# EAGLE design node-double (EAGLE 9.1.1)
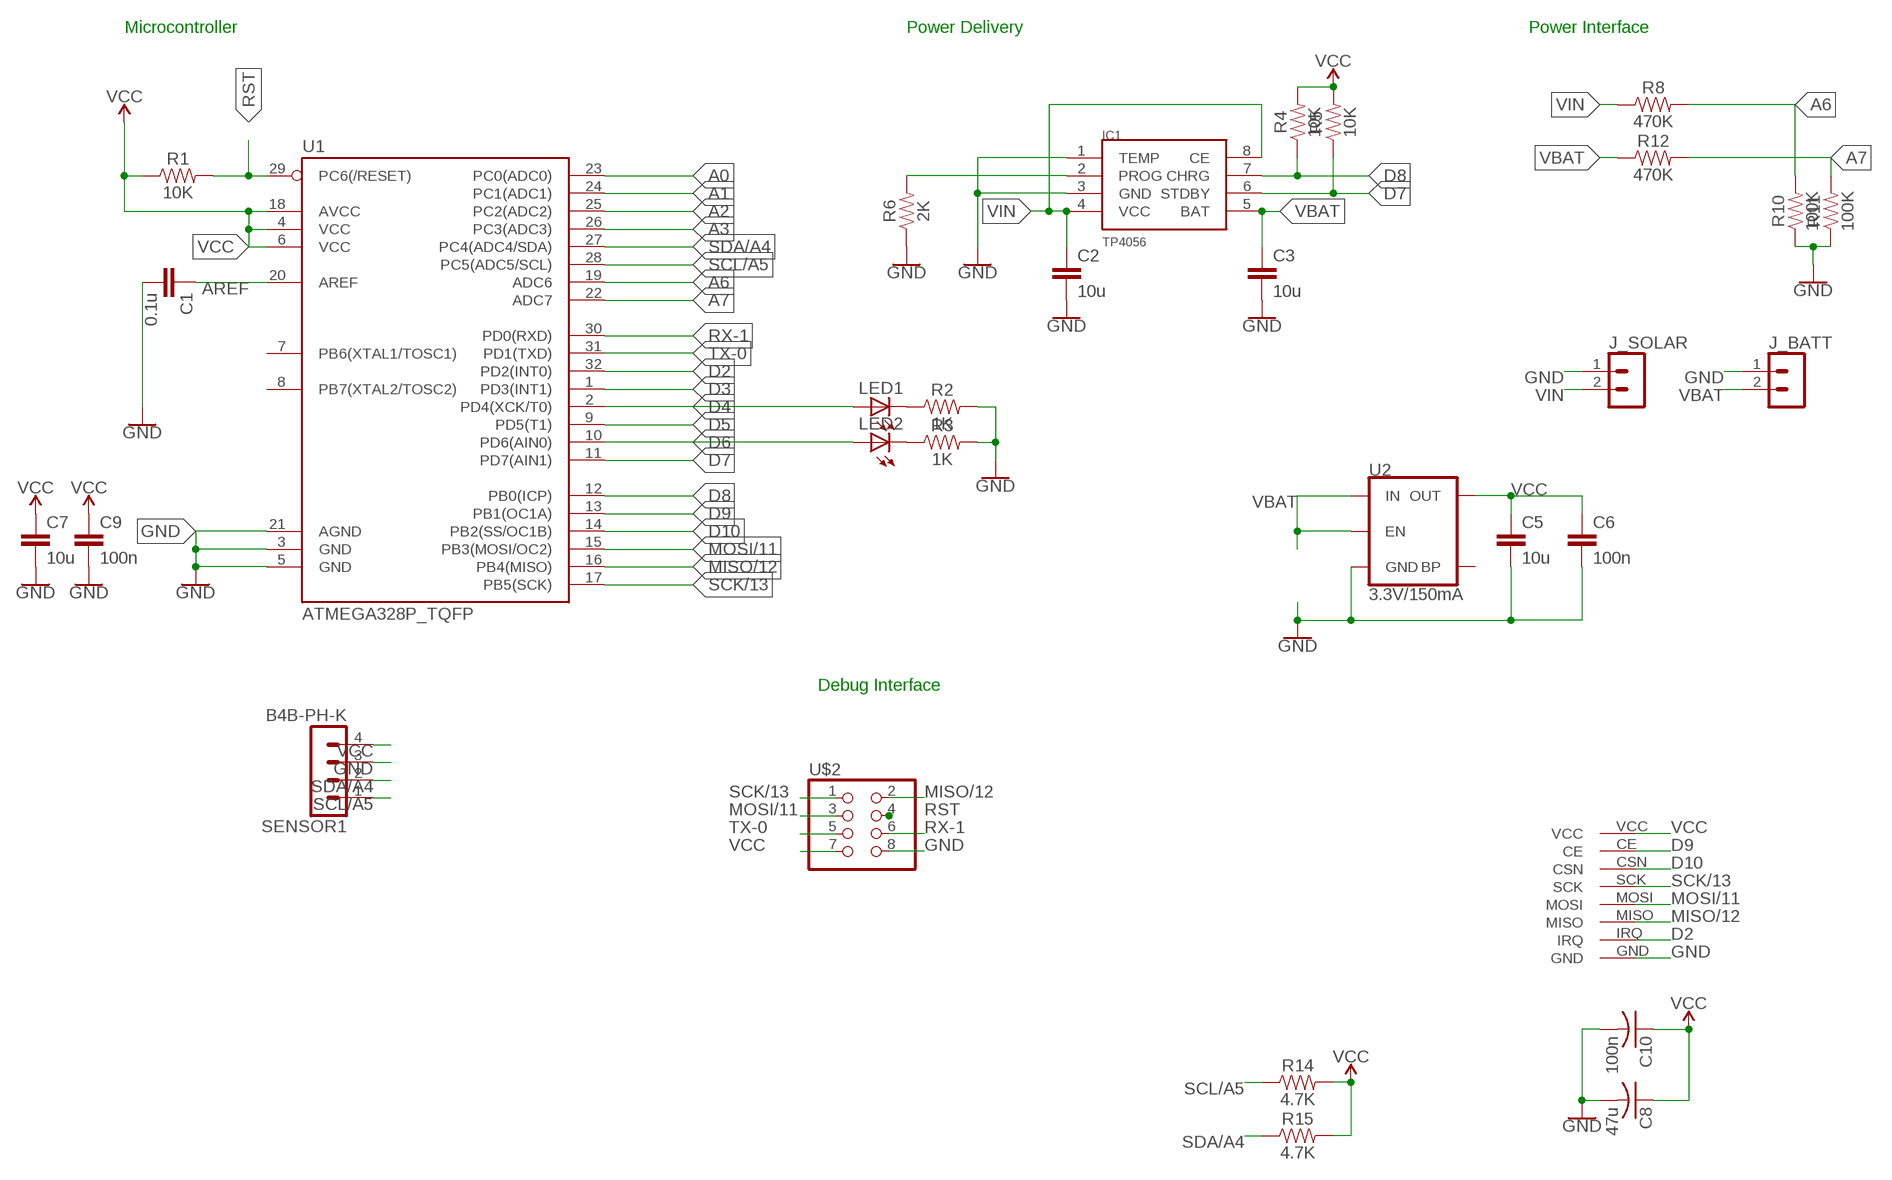
[diagram p0: schematic, sheet 1]

## Parts
C1  0.1u  CAPACITOR_0603_L  [RESC0603_L]
C2  10u  CAPACITOR_0603_L  [RESC0603_L]
C3  10u  CAPACITOR_0603_L  [RESC0603_L]
C5  10u  CAPACITOR_0603_L  [RESC0603_L]
C6  100n  CAPACITOR_0603_L  [RESC0603_L]
C7  10u  CAPACITOR_0603_L  [RESC0603_L]
C8  47u  C-USC0603  [C0603]
C9  100n  CAPACITOR_0603_L  [RESC0603_L]
C10  100n  C-USC0603  [C0603]
IC1  TP4056  [SOP-8]
J_BATT  B2B-PH-K  [B2B-PH-K]
J_SOLAR  B2B-PH-K  [B2B-PH-K]
LED1  LEDSML0805  [SML0805]
LED2  LEDSML0805  [SML0805]
R1  10K  RESISTOR0603  [0603]
R2  1K  RESISTOR0603  [0603]
R3  1K  RESISTOR0603  [0603]
R4  10K  RESISTOR0603  [0603]
R5  10K  RESISTOR0603  [0603]
R6  2K  RESISTOR0603  [0603]
R8  470K  RESISTOR0603  [0603]
R10  100K  RESISTOR0603  [0603]
R11  100K  RESISTOR0603  [0603]
R12  470K  RESISTOR0603  [0603]
R14  4.7K  RESISTOR0603  [0603]
R15  4.7K  RESISTOR0603  [0603]
SENSOR1  B4B-PH-K  [B4B-PH-K]
U1  ATMEGA328P_TQFP  [TQFP32-08]
U2  3.3V/150mA  V_REG_MIC52053.3V  [SOT23-5]
U$1  ML01SSMD-SOM  [ML01S]
U$2  PINHD-2X4  [2X04]

## Nets
A0: U1.23(PC0(ADC0))
A1: U1.24(PC1(ADC1))
A2: U1.25(PC2(ADC2))
A3: U1.26(PC3(ADC3))
A6: R8.2 R10.2 U1.19(ADC6)
A7: R11.2 R12.2 U1.22(ADC7)
AREF: C1.1 U1.20(AREF)
D2: U1.32(PD2(INT0)) U$1.IRQ
D3: U1.1(PD3(INT1))
D4: LED1.A U1.2(PD4(XCK/T0))
D5: U1.9(PD5(T1))
D6: LED2.A U1.10(PD6(AIN0))
D7: IC1.6(STDBY) R5.1 U1.11(PD7(AIN1))
D8: IC1.7(CHRG) R4.1 U1.12(PB0(ICP))
D9: U1.13(PB1(OC1A)) U$1.CE
D10: U1.14(PB2(SS/OC1B)) U$1.CSN
GND: C1.2 C2.2 C3.2 C5.2 C6.2 C7.2 C8.2 C9.2 C10.2 IC1.1(TEMP) IC1.3(GND) J_BATT.1 J_SOLAR.1 R2.2 R3.2 R6.1 R10.1 R11.1 SENSOR1.3 U1.3(GND) U1.5(GND) U1.21(AGND) U2.2(GND) U$1.GND U$2.8
MISO/12: U1.16(PB4(MISO)) U$1.MISO U$2.2
MOSI/11: U1.15(PB3(MOSI/OC2)) U$1.MOSI U$2.3
N$1: LED1.C R2.1
N$2: LED2.C R3.1
PROG: IC1.2(PROG) R6.2
RST: R1.2 U1.29(PC6(/RESET)) U$2.4
RX-1: U1.30(PD0(RXD)) U$2.6
SCK/13: U1.17(PB5(SCK)) U$1.SCK U$2.1
SCL/A5: R14.1 SENSOR1.1 U1.28(PC5(ADC5/SCL))
SDA/A4: R15.1 SENSOR1.2 U1.27(PC4(ADC4/SDA))
TX-0: U1.31(PD1(TXD)) U$2.5
VBAT: C3.1 IC1.5(BAT) J_BATT.2 R12.1 U2.1(IN) U2.3(EN)
VCC: C5.1 C6.1 C7.1 C8.1 C9.1 C10.1 R1.1 R4.2 R5.2 R14.2 R15.2 SENSOR1.4 U1.4(VCC) U1.6(VCC) U1.18(AVCC) U2.5(OUT) U$1.VCC U$2.7
VIN: C2.1 IC1.4(VCC) IC1.8(CE) J_SOLAR.2 R8.1
Unconnected: U1.7(PB6(XTAL1/TOSC1)) U1.8(PB7(XTAL2/TOSC2)) U2.4(BP)

## Notes on the sheet
- Microcontroller | Power Delivery | Power Interface
- Debug Interface

## Library data of the parts
C1 = Nordic_nRF:CAPACITOR: Generic chip capacitor; MF: YAGEO (PHYCOMP); MPN: CC0603KRX7R7BB104; OC_FARNELL: 432210
C2 C3 C5-C7 C9 = Nordic_nRF:CAPACITOR: Generic chip capacitor; MF: AVX; MPN: 08056D106KAT2A; OC_FARNELL: 1301818
C8 C10 = resistor:C-US: CAPACITOR, American symbol; MF: AVX; MPN: 08056D106KAT2A; OC_FARNELL: 1301818
IC1 = TP4056:TP4056; OC_FARNELL: unknown
J_BATT J_SOLAR = con-jst-ph:B2B-PH-K: HEADER
LED1 LED2 = led:LED: LED OSRAM: - CHIPLED LG R971, LG N971, LY N971, LG Q971, LY Q971, LO R971, LY R971 LH N974, LH R974 LS Q976, LO Q976, LY Q976 LO Q996 - Hyper CHIPLED LW Q18S LB Q993, LB Q99A, LB R99A - SideLED LS A670, LO A670, LY A670, LG A670, LP A670 LB A673, LV A673, LT A673, LW A673 LH A674 LY A675 LS A676, LA A676, LO A676, LY A676, LW A676 LS A679, LY A679, LG A679 - Hyper Micro SIDELED® LS Y876, LA Y876, LO Y876, LY Y876 LT Y87S - SmartLED LW L88C, LW L88S LB L89C, LB L89S, LG L890 LS L89K, LO L89K, LY L89K LS L896, LA L896, LO L896, LY L896 - TOPLED LS T670, LO T670, LY T670, LG T670, LP T670 LSG T670, LSP T670, LSY T670, LOP T670, LYG T670 LG T671, LOG T671, LSG T671 LB T673, LV T673, LT T673, LW T673 LH T674 LS T676, LA T676, LO T676, LY T676, LB T676, LH T676, LSB T676, LW T676 LB T67C, LV T67C, LT T67C, LS T67K, LO T67K, LY T67K, LW E67C LS E67B, LA E67B, LO E67B, LY E67B, LB E67C, LV E67C, LT E67C LW T67C LS T679, LY T679, LG T679 LS T770, LO T770, LY T770, LG T770, LP T770 LB T773, LV T773, LT T773, LW T773 LH T774 LS E675, LA E675, LY E675, LS T675 LS T776, LA T776, LO T776, LY T776, LB T776 LHGB T686 LT T68C, LB T68C - Hyper Mini TOPLED® LB M676 - Mini TOPLED Santana® LG M470 LS M47K, LO M47K, LY M47K Source: http://www.osram.convergy.de LUXEON: - LUMILED® LXK2-PW12-R00, LXK2-PW12-S00, LXK2-PW14-U00, LXK2-PW14-V00 LXK2-PM12-R00, LXK2-PM12-S00, LXK2-PM14-U00 LXK2-PE12-Q00, LXK2-PE12-R00, LXK2-PE12-S00, LXK2-PE14-T00, LXK2-PE14-U00 LXK2-PB12-K00, LXK2-PB12-L00, LXK2-PB12-M00, LXK2-PB14-N00, LXK2-PB14-P00, LXK2-PB14-Q00 LXK2-PR12-L00, LXK2-PR12-M00, LXK2-PR14-Q00, LXK2-PR14-R00 LXK2-PD12-Q00, LXK2-PD12-R00, LXK2-PD12-S00 LXK2-PH12-R00, LXK2-PH12-S00 LXK2-PL12-P00, LXK2-PL12-Q00, LXK2-PL12-R00 Source: www.luxeon.com KINGBRIGHT: KA-3528ASYC Source: www.kingbright.com
R1-R5 = SparkFun-Resistors:RESISTOR: Generic Resistor Package; OC_FARNELL: unknown
R6 = SparkFun-Resistors:RESISTOR: Generic Resistor Package; MF: BOURNS; MPN: CR0805-JW-222ELF; OC_FARNELL: 2336287
R8 R12 = SparkFun-Resistors:RESISTOR: Generic Resistor Package; MF: MULTICOMP; MPN: MC01W08051330K; OC_FARNELL: 2129316
R10 R11 = SparkFun-Resistors:RESISTOR: Generic Resistor Package; MF: VISHAY; MPN: CRCW0805100KFKEA; OC_FARNELL: 1469860
R14 R15 = SparkFun-Resistors:RESISTOR: Generic Resistor Package; MF: YAGEO; MPN: RC0805JR-074K7L; OC_FARNELL: 1799499
SENSOR1 = con-jst-ph:B4B-PH-K: HEADER
U1 = SparkFun-IC-Microcontroller:ATMEGA328P_TQFP: Popular 328P in QFP Storefront component: ATmega328 - TQFP <https://www.sparkfun.com/products/13448> (COM-13448) Datasheet <http://www.sparkfun.com/datasheets/Components/SMD/ATMega328.pdf> SparkFun Products SparkFun RedBoard - Programmed with Arduino <https://www.sparkfun.com/products/12757> (DEV-12757) Arduino Pro Mini 328 - 5V/16MHz <https://www.sparkfun.com/products/11113> (DEV-11113) Arduino Pro Mini 328 - 3.3V/8MHz <https://www.sparkfun.com/products/11114> (DEV-11114) SparkFun OpenLog <https://www.sparkfun.com/products/13712> (DEV-13712) SparkFun MicroView - OLED Arduino Module <https://www.sparkfun.com/products/12923> (DEV-12923) SparkFun Digital Sandbox <https://www.sparkfun.com/products/12651> (DEV-12651) SparkFun PicoBoard <https://www.sparkfun.com/products/11888> (WIG-11888) Arduino Fio <https://www.sparkfun.com/products/10116> (DEV-10116) LilyPad Arduino 328 Main Board <https://www.sparkfun.com/products/13342> (DEV-13342) SparkFun RedStick <https://www.sparkfun.com/products/13741> (DEV-13741) LilyPad MP3 <https://www.sparkfun.com/products/11013> (DEV-11013) LilyPad Arduino SimpleSnap <https://www.sparkfun.com/products/10941> (DEV-10941) SparkFun Stepoko <https://www.sparkfun.com/products/13899> (ROB-13899) SparkFun Geiger Counter <https://www.sparkfun.com/products/11345> (SEN-11345) SparkFun EL Sequencer <https://www.sparkfun.com/products/12781> (COM-12781) Arduino Pro 328 - 5V/16MHz <https://www.sparkfun.com/products/10915> (DEV-10915) CryptoCape <https://www.sparkfun.com/products/12773> (DEV-12773) SparkFun IR Thermometer Evaluation Board - MLX90614 <https://www.sparkfun.com/products/10740> (SEN-10740) SparkFun RedBot Mainboard <https://www.sparkfun.com/products/12097> (ROB-12097) Arduino Pro 328 - 3.3V/8MHz <https://www.sparkfun.com/products/10914> (DEV-10914) SparkFun Block for Intel® Edison - Arduino <https://www.sparkfun.com/products/13036> (DEV-13036) SparkFun Simon Says - Surface Mount Soldering Kit <https://www.sparkfun.com/products/10935> (KIT-10935) SparkFun 7-Segment Serial Display - Red <https://www.sparkfun.com/products/11441> (COM-11441) SparkFun 7-Segment Serial Display - White <https://www.sparkfun.com/products/11629> (COM-11629) SparkFun 7-Segment Serial Display - Yellow <https://www.sparkfun.com/products/11443> (COM-11443) SparkFun 7-Segment Serial Display - Kelly Green <https://www.sparkfun.com/products/11440> (COM-11440) SparkFun 7-Segment Serial Display - Blue <https://www.sparkfun.com/products/11442> (COM-11442) SparkFun OpenSegment Serial Display - 20mm (Blue) <https://www.sparkfun.com/products/11647> (COM-11647) SparkFun OpenSegment Serial Display - 20mm (Green) <https://www.sparkfun.com/products/11646> (COM-11646) SparkFun OpenSegment Serial Display - 20mm (White) <https://www.sparkfun.com/products/11648> (COM-11648) SparkFun OpenSegment Serial Display - 20mm (Red) <https://www.sparkfun.com/products/11644> (COM-11644) SparkFun OpenSegment Serial Display - 20mm (Yellow) <https://www.sparkfun.com/products/11645> (COM-11645) SparkFun OpenSegment Shield <https://www.sparkfun.com/products/13190> (DEV-13190); MF: MICROCHIP; MPN: ATMEGA328P-AU; OC_FARNELL: 1715486; PROD_ID: IC-09069
U2 = SparkFun-IC-Power:V_REG_MIC5205: V_REG MIC5205 Standard 3.3V, 5V, and Adjustable 150mA LDO voltage regulator in SOT-23 layout. Micrel part MIC5205. BP (by-pass) pin is used to lower output noise with 470pF cap, may be left open. On the adjustable version BP is used to set output.; PROD_ID: VREG-00822
U$1 = ebyte:ML01S
U$2 = pinhead:PINHD-2X4: PIN HEADER

## Net classes
1 VCC: width 0.635 mm

## Board
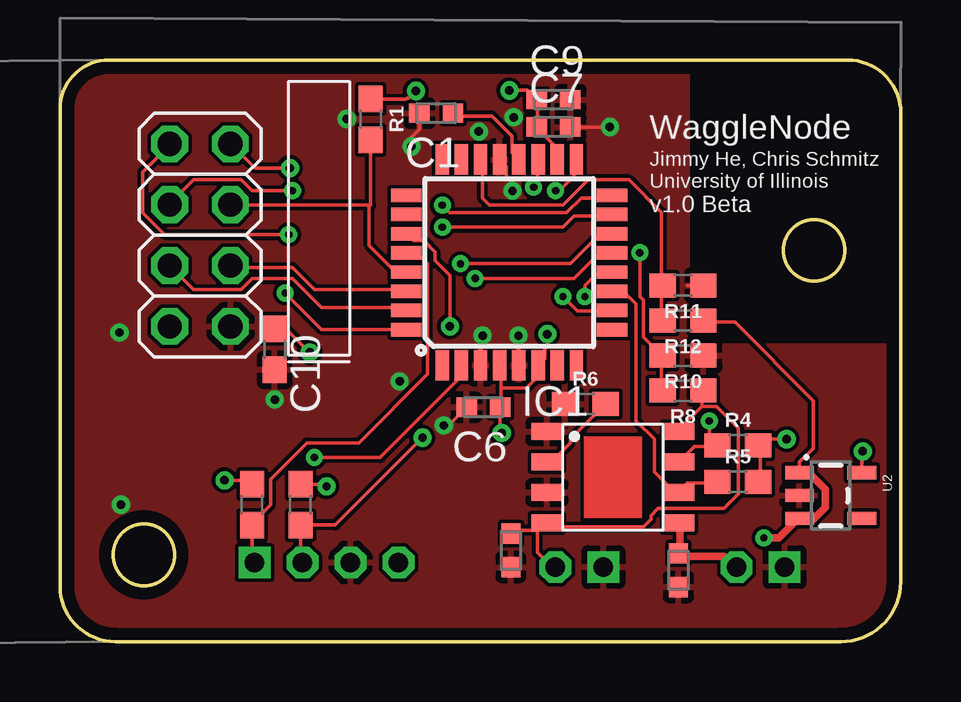
[diagram p1: board, top side]
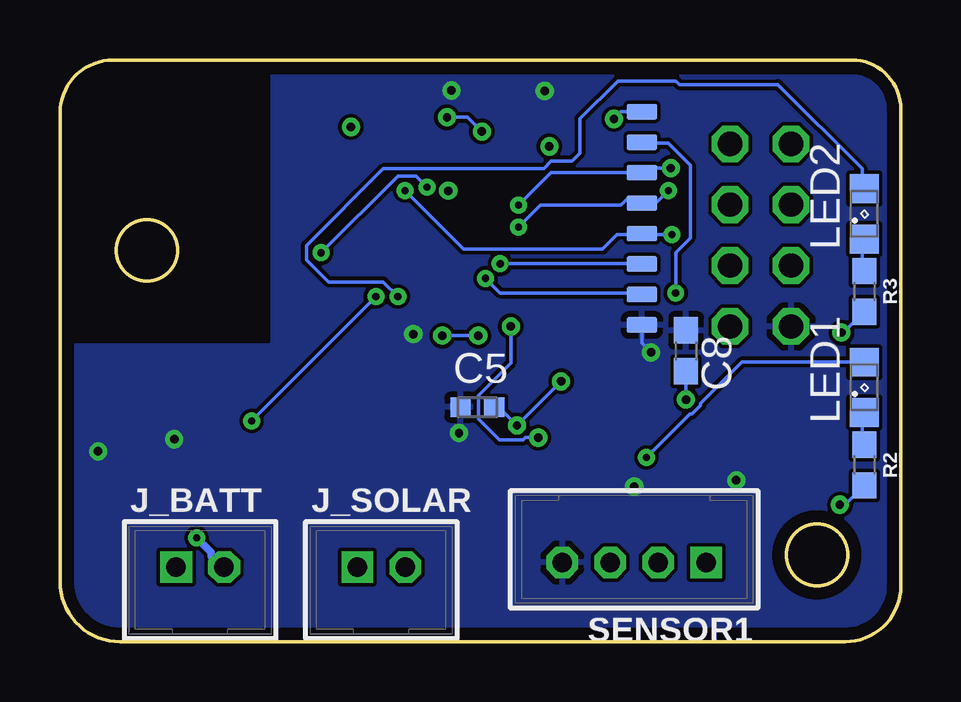
[diagram p2: board, bottom side, seen from below]

Size 35.05 x 24.26 mm. Coordinates in mm from the lower left corner, seen from the top.
Outline: 0,22.21 0,2.32 arc90 2.32,0 32.55,0 arc90 35.05,2.5 35.05,22.03 arc90 32.83,24.26 2.05,24.26 arc90 0,22.21
Outline: circle at 31.43,16.32 radius 1.27
Outline: circle at 3.49,3.62 radius 1.27
Copper layers (1*16): Top 0.035mm / dielectric 1.5mm / Bottom 0.035mm
Design rules "default *": minimum track width 6mil, minimum drill 0.3mm, track to track 6mil, track to pad 6mil, pad to pad 6mil, via to via 6mil, smd to smd 6mil, copper to edge 20mil, drill to drill 6mil, minimum pad ring 10mil, minimum via ring 8mil, stop-mask expansion 4mil, vias tented up to drill 14mil, thermal gap 10mil

### Footprints (pad centres in the part's own frame; a part is rotated, then mirrored left to right if it is on the bottom)
RESC0603_L = smd 0.85 x 0.8: 1 -0.7,0; 2 0.7,0
C0603 = smd 1.1 x 1: 1 -0.85,0; 2 0.85,0
SOP-8 = smd 1.3 x 0.7: 1 -2.75,1.905; 2 -2.75,0.635; 3 -2.75,-0.635; 4 -2.75,-1.905; 5 2.75,-1.905; 6 2.75,-0.635; 7 2.75,0.635; 8 2.75,1.905
B2B-PH-K = drill 0.813 square: 1 -1,0 | drill 0.813 octagon: 2 1,0
SML0805 = smd 1.2 x 1.2: A 1.05,0; C -1.05,0
0603 = smd 1.1 x 1: 1 -0.85,0; 2 0.85,0
B4B-PH-K = drill 0.813 square: 1 -3,0 | drill 0.813 octagon: 2 -1,0; 3 1,0; 4 3,0
TQFP32-08 = smd 1.27 x 0.559: 1 -4.293,2.8; 2 -4.293,2; 3 -4.293,1.2; 4 -4.293,0.4; 5 -4.293,-0.4; 6 -4.293,-1.2; 7 -4.293,-2; 8 -4.293,-2.8; 17 4.293,-2.8; 18 4.293,-2; 19 4.293,-1.2; 20 4.293,-0.4; 21 4.293,0.4; 22 4.293,1.2; 23 4.293,2; 24 4.293,2.8 | smd 0.559 x 1.27: 9 -2.8,-4.293; 10 -2,-4.293; 11 -1.2,-4.293; 12 -0.4,-4.293; 13 0.4,-4.293; 14 1.2,-4.293; 15 2,-4.293; 16 2.8,-4.293; 25 2.8,4.293; 26 2,4.293; 27 1.2,4.293; 28 0.4,4.293; 29 -0.4,4.293; 30 -1.2,4.293; 31 -2,4.293; 32 -2.8,4.293
SOT23-5 = smd 0.55 x 1.2: 1 -0.95,-1.3; 2 0,-1.3; 3 0.95,-1.3; 4 0.95,1.3; 5 -0.95,1.3
ML01S = smd 1.27 x 0.635: CE 1.27,-1.27; CSN 1.27,-2.54; GND 1.27,-8.89; IRQ 1.27,-7.62; MISO 1.27,-6.35; MOSI 1.27,-5.08; SCK 1.27,-3.81; VCC 1.27,0
2X04 = drill 1.016 octagon: 1 -3.81,-1.27; 2 -3.81,1.27; 3 -1.27,-1.27; 4 -1.27,1.27; 5 1.27,-1.27; 6 1.27,1.27; 7 3.81,-1.27; 8 3.81,1.27

### Placement (x,y rotation side)
C1  15.68,22.03 180 top
C2  18.8,3.81 270 top
C3  25.78,2.98 270 top
C5  17.65,9.78 0 bottom
C6  17.65,9.78 180 top
C7  20.57,21.46 0 top
C8  8.95,12.13 270 bottom
C9  20.57,22.61 0 top
C10  8.95,12.19 270 top
IC1  23.05,6.86 0 top
J_BATT  29.21,3.11 0 bottom
J_SOLAR  21.65,3.11 0 bottom
LED1  1.52,10.6 90 bottom
LED2  1.52,17.84 90 bottom
R1  12.95,21.78 270 top
R2  1.52,7.37 270 bottom
R3  1.52,14.6 270 bottom
R4  28.26,8.19 0 top
R5  28.26,6.67 0 top
R6  21.91,9.91 0 top
R8  25.97,10.48 180 top
R10  25.97,11.94 180 top
R11  25.97,14.86 180 top
R12  25.97,13.4 180 top
R14  8,5.71 90 top
R15  10.03,5.71 90 top
SENSOR1  11.11,3.3 180 bottom
U1  18.73,15.81 90 top
U2  32.13,6.1 270 top
U$1  9.53,13.21 180 bottom
U$2  5.84,16.95 270 top

### Tracks (layer width: path | path; a pad name or v marks a point on that pad's centre or on a via)
A6  (via drill 0.3)
  Top 0.152: R8.2 25.08,10.58 25.08,11.8 R10.2 25.08,11.95 24.32,12.71 24.32,14.24 24.17,14.39 v24.17,16.22 | v19.75,18.96 19.9,19.11 19.9,20.03 U1.19
  Bottom 0.152: v19.75,18.96 20.21,19.42 20.97,19.42 v24.17,16.22
A7
  Top 0.152: R12.2 25.08,13.47 25.08,14.85 R11.2 25.08,15 25.08,17.89 23.71,19.27 22.03,19.27 20.97,18.2 17.91,18.2 17.61,18.49 17.61,20.03 U1.22
AREF
  Top 0.152: C1.1 16.5,21.92 18.01,21.92 18.84,21.09 18.84,20.4 U1.20
D2  (via drill 0.3)
  Top 0.152: v9.39,14.54 10.91,13.02 14.41,13.02 U1.32
  Bottom 0.152: v9.39,14.54 9.39,16.22 8.78,16.83 8.78,19.88 9.69,20.79 10.76,20.79 U$1.IRQ
D4  (via drill 0.3)
  Top 0.152: v10.6,7.68 13.35,7.68 16.7,11.04 16.7,11.49 U1.2
  Bottom 0.152: LED1.A 6.63,11.65 8.35,9.94 8.35,9.85 8.7,9.49 8.8,9.49 v10.6,7.68
D6  (via drill 0.3)
  Top 0.152: v20.97,14.39 21.58,13.78 22.95,13.78 U1.10
  Bottom 0.152: v20.97,14.39 21.58,15 23.86,15 24.78,15.91 24.78,16.52 21.58,19.72 14.88,19.72 14.58,20.03 13.72,20.03 13.38,20.37 13.38,21.8 11.8,23.38 9.39,23.38 9.23,23.23 5.12,23.23 1.61,19.72 1.61,18.96 LED2.A
D7
  Top 0.152: R5.1 27.37,6.62 26.15,6.62 25.84,6.31 IC1.6 25.69,6.16 24.78,7.07 24.78,8.45 24.02,9.21 24.02,14.08 23.56,14.54 23.1,14.54 U1.11
D8  (via drill 0.3)
  Top 0.152: 27.06,8.14 26.45,8.14 25.84,7.53 IC1.7 | 27.06,8.14 27.37,8.14 R4.1 27.06,8.14 | v21.88,14.39 21.88,14.85 22.34,15.3 22.95,15.3 U1.12 | 27.06,8.14 v27.06,9.21
  Bottom 0.152: v27.06,9.21 v21.88,14.39
D9  (via drill 0.3)
  Top 0.152: v17.31,15.15 21.42,15.15 22.34,16.07 22.95,16.07 U1.13
  Bottom 0.152: v17.31,15.15 16.7,14.54 10.91,14.54 U$1.CE
D10  (via drill 0.3)
  Top 0.152: v16.7,15.76 21.27,15.76 22.49,16.98 22.95,16.98 U1.14
  Bottom 0.152: v16.7,15.76 10.91,15.76 U$1.CSN
GND  (via drill 0.35)
  Top 0.152: C1.2 14.98,21.37 14.65,21.03 v14.65,20.65 | C7.2 v22.92,21.46 | U1.3 17.53,12.68 v17.62,12.76 | v19.11,12.76 19.11,11.54 U1.5 | v16,9.02 16.19,9.02 C6.2 | U1.21 18.62,19.81 18.62,19.37 18.86,19.13 v18.86,18.81 | R11.1 26.16,14.86
  Bottom 0.152: U$1.GND 11.66,22.1 v11.96,21.8 | v17.62,12.76 v19.11,12.76 | C6.2 16.76,9.78 v16,9.02 v14.16,10.86 | v18.92,21.87 18.06,21.87 v17.46,21.27 | C8.2 v8.95,10.1 | R3.2 2.39,12.89 v2.48,12.89 | R2.2 2.32,5.72 v2.54,5.72
  pour Top (isolate 0.152): -4.32,24.26 -4.32,-5.46 -4.38,-5.52 36.45,-5.52 36.51,-5.46 36.51,25.34 36.77,25.59 -3.11,25.59 -4.19,24.51 -4.19,24.38
  cutout Top: 26.35,25.21 26.35,12.51 36.51,12.51 36.51,25.21
  cutout Bottom: 26.35,25.21 26.35,12.51 36.51,12.51 36.51,25.21
MISO/12  (via drill 0.3, 0.35)
  Top 0.152: v15.94,18.2 16.24,17.89 21.12,17.89 21.73,18.5 22.95,18.5 U1.16 | v9.59,19.75 8.13,19.75 U$2.2
  Bottom 0.152: v15.94,18.2 14.58,19.56 U$1.MISO 10.6,19.75 v9.59,19.75
MOSI/11  (via drill 0.3)
  Top 0.152: v9.69,18.81 8.01,18.81 7.56,19.27 5.58,19.27 4.66,18.35 U$2.3 | v15.94,17.28 20.97,17.28 21.42,17.74 22.95,17.74 U1.15
  Bottom 0.152: v9.69,18.81 10.15,18.35 10.76,18.35 U$1.MOSI 10.91,18.35 11.06,18.5 11.37,18.5 11.67,18.2 15.02,18.2 v15.94,17.28
N$1
  Bottom 0.152: R2.1 1.61,8.29 1.61,9.51 LED1.C
N$2
  Bottom 0.152: R3.1 1.61,15.46 1.61,16.68 LED2.C
PROG
  Top 0.152: R6.2 22.64,9.82 21.27,8.45 21.27,8.29 20.36,7.38 IC1.2
RST
  Top 0.152: 12.89,18.2 12.89,16.52 13.96,15.46 14.41,15.46 U1.29 | R1.2 12.95,18.2 12.89,18.2 | U$2.4 7.25,18.2 12.89,18.2
RX-1
  Top 0.152: U1.30 14.41,14.69 10.6,14.69 9.69,15.61 7.25,15.61 U$2.6
SCK/13  (via drill 0.3)
  Top 0.152: v9.54,16.98 4.36,16.98 3.44,17.89 3.44,19.57 4.51,20.64 U$2.1 | v20.66,18.81 20.82,18.81 21.42,19.42 21.42,20.03 U1.17
  Bottom 0.152: v9.54,16.98 10.76,16.98 U$1.SCK 10.91,16.98 11.82,16.98 12.43,16.37 18.22,16.37 v20.66,18.81
SCL/A5
  Top 0.152: 8.01,4.79 R14.1 | U1.28 14.57,16.07 15.02,16.07 15.33,15.76 15.33,11.16 12.46,8.29 10.3,8.29 8.78,6.77 8.78,5.7 8.01,4.94 R14.1 | R14.1 8,3.41 SENSOR1.1
SDA/A4  (via drill 0.35)
  Top 0.152: 9.99,4.79 R15.1 | U1.27 14.73,16.72 15.17,16.72 15.63,16.26 15.63,15.89 16.26,15.26 v16.26,13.14 | v15.11,8.51 11.47,4.86 R15.1 | R15.1 10.03,3.38 SENSOR1.2
  Bottom 0.152: v15.11,8.51 15.65,8.51 15.75,8.41 16.73,8.41 17.61,9.28 17.61,10.27 16.26,11.62 v16.26,13.14
TX-0
  Top 0.152: U1.31 14.41,13.93 10.91,13.93 9.69,15.15 8.01,15.15 7.56,14.69 5.58,14.69 4.66,15.61 U$2.5
VBAT  (via drill 0.3)
  Top 0.152: 26.91,13.32 28.13,13.32 31.4,10.05 31.4,8.07 30.83,7.49 U2.1
  Top 0.305: IC1.5 25.84,4.94 25.84,3.72 C3.1 25.84,3.57 27.67,3.57 28.13,3.11 J_BATT.2 | 26.91,13.32 R12.1 | v29.35,4.33 29.96,4.33 30.72,5.09 U2.3 30.86,5.11 31.36,5.05 31.91,5.6 31.91,6.34 31.21,7.05 U2.1
  Bottom 0.305: v29.35,4.33 28.74,3.72 28.74,3.57 28.28,3.11 J_BATT.2
VCC  (via drill 0.35)
  Top 0.152: U1.18 20.66,20.18 20.66,20.64 19.9,21.4 C7.1 19.9,21.55 19.9,22.47 C9.1 19.49,22.99 v18.73,22.99 | R5.2 29.2,6.77 29.2,7.53 29.2,8.14 R4.2 29.36,8.45 v30.29,8.45 | 18.38,10.58 18.38,11.49 U1.4 | 18.38,10.58 18.38,9.82 C6.1 18.35,8.76 v18.42,8.7 | 18.38,10.58 19.44,10.58 19.9,11.04 19.9,11.49 U1.6 20.22,11.81 20.22,12.25 20.32,12.34 v20.32,12.83 | C10.1 9.44,13.04 v10.41,12.06 | R15.2 11.02,6.57 v11.11,6.48 | R14.2 7.84,6.73 v6.86,6.73 | R1.1 14.43,22.63 14.46,22.66 14.54,22.66 v14.84,22.97 | U2.5 33.43,7.9 v33.46,7.94
  Bottom 0.152: v10.41,12.06 10.8,12.45 U$1.VCC
  pour Bottom (isolate 0.152): -4.64,24.7 -4.64,-5.84 -4.76,-5.97 36,-5.97 36.2,-5.78 36.2,25.02 -4.25,25.21 -4.7,24.77
VIN
  Top 0.152: 26.76,9.82 26.76,10.43 R8.1 | 26.76,9.82 25.84,8.9 IC1.8 | 19.9,4.64 18.83,4.64 C2.1 | 19.9,4.64 20.21,4.94 IC1.4 | 19.9,4.64 19.9,3.72 20.51,3.11 J_SOLAR.2 | 19.9,4.64 IC1.4 | 26.76,9.82 27.37,9.82 28.28,8.9 28.28,6.16 27.67,5.55 24.93,5.55 24.63,5.25 24.63,5.09 24.32,4.79 20.21,4.79 IC1.4

### Text on the board
tPlace: WaggleNode | Jimmy He, Chris Schmitz / University of Illinois | v1.0 Beta